# EAGLE design M105-bad (EAGLE 6.6.0)
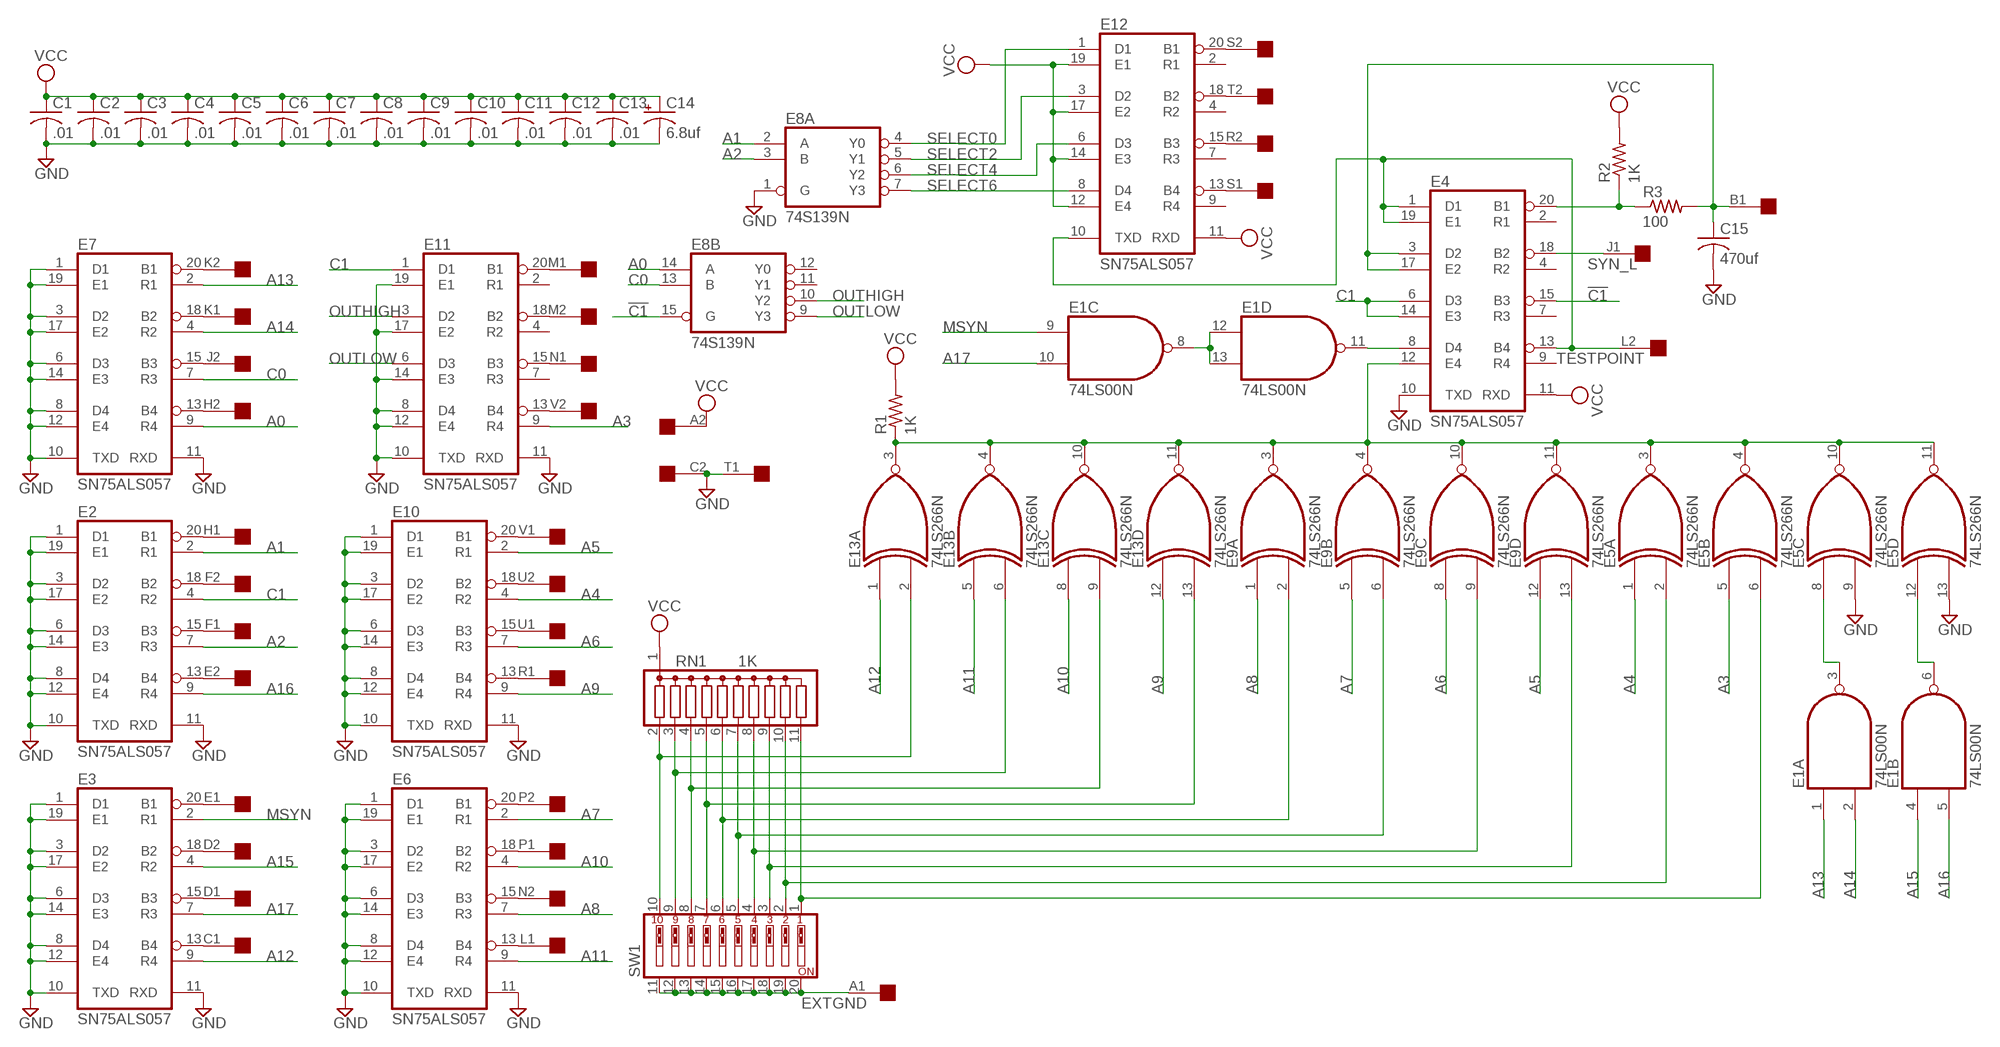
[diagram p0: schematic, sheet 1]

## Parts
C1  .01  C-US050-025X075  [C050-025X075]
C2  .01  C-US050-025X075  [C050-025X075]
C3  .01  C-US050-025X075  [C050-025X075]
C4  .01  C-US050-025X075  [C050-025X075]
C5  .01  C-US050-025X075  [C050-025X075]
C6  .01  C-US050-025X075  [C050-025X075]
C7  .01  C-US050-025X075  [C050-025X075]
C8  .01  C-US050-025X075  [C050-025X075]
C9  .01  C-US050-025X075  [C050-025X075]
C10  .01  C-US050-025X075  [C050-025X075]
C11  .01  C-US050-025X075  [C050-025X075]
C12  .01  C-US050-025X075  [C050-025X075]
C13  .01  C-US050-025X075  [C050-025X075]
C14  6.8uf  CPOL-USE15-5AXIAL  [E15-5]
C15  470uf  C-US050-025X075  [C050-025X075]
E1  74LS00N  [DIL14]
E2  SN75ALS057  [DIL20]
E3  SN75ALS057  [DIL20]
E4  SN75ALS057  [DIL20]
E5  74LS266N  [DIL14]
E6  SN75ALS057  [DIL20]
E7  SN75ALS057  [DIL20]
E8  74S139N  [DIL16]
E9  74LS266N  [DIL14]
E10  SN75ALS057  [DIL20]
E11  SN75ALS057  [DIL20]
E12  SN75ALS057  [DIL20]
E13  74LS266N  [DIL14]
R1  1K  R-US_0207/10  [0207/10]
R2  1K  R-US_0207/10  [0207/10]
R3  100  R-US_0207/10  [0207/10]
RN1  1K  G10R  [SIL11]
SW1  SW_DIP-10  [EDG-10]
U$1  SINGLE  [EDGE-CON2]

## Nets
!C1: E4.15(B3) E8.15(B:G)
A0: E7.9(R4) E8.14(B:A)
A1: E2.2(R1) E8.2(A:A)
A2: E2.7(R3) E8.3(A:B)
A3: E5.5(B:I0) E11.9(R4)
A4: E5.1(A:I0) E10.4(R2)
A5: E9.12(D:I0) E10.2(R1)
A6: E9.8(C:I0) E10.7(R3)
A7: E6.2(R1) E9.5(B:I0)
A8: E6.7(R3) E9.1(A:I0)
A9: E10.9(R4) E13.12(D:I0)
A10: E6.4(R2) E13.8(C:I0)
A11: E6.9(R4) E13.5(B:I0)
A12: E3.9(R4) E13.1(A:I0)
A13: E1.1(A:I0) E7.2(R1)
A14: E1.2(A:I1) E7.4(R2)
A15: E1.4(B:I0) E3.4(R2)
A16: E1.5(B:I1) E2.9(R4)
A17: E1.10(C:I1) E3.7(R3)
C0: E7.7(R3) E8.13(B:B)
C1: E2.4(R2) E4.6(D3) E4.14(E3) E11.1(D1)
EXTGND: SW1.11 SW1.12 SW1.13 SW1.14 SW1.15 SW1.16 SW1.17 SW1.18 SW1.19 SW1.20 U$1.A1
GND: C1.2 C2.2 C3.2 C4.2 C5.2 C6.2 C7.2 C8.2 C9.2 C10.2 C11.2 C12.2 C13.2 C14.- C15.2 E2.1(D1) E2.3(D2) E2.6(D3) E2.8(D4) E2.10(TXD) E2.11(RXD) E2.12(E4) E2.14(E3) E2.17(E2) E2.19(E1) E3.1(D1) E3.3(D2) E3.6(D3) E3.8(D4) E3.10(TXD) E3.11(RXD) E3.12(E4) E3.14(E3) E3.17(E2) E3.19(E1) E4.10(TXD) E5.9(C:I1) E5.13(D:I1) E6.1(D1) E6.3(D2) E6.6(D3) E6.8(D4) E6.10(TXD) E6.11(RXD) E6.12(E4) E6.14(E3) E6.17(E2) E6.19(E1) E7.1(D1) E7.3(D2) E7.6(D3) E7.8(D4) E7.10(TXD) E7.11(RXD) E7.12(E4) E7.14(E3) E7.17(E2) E7.19(E1) E8.1(A:G) E10.1(D1) E10.3(D2) E10.6(D3) E10.8(D4) E10.10(TXD) E10.11(RXD) E10.12(E4) E10.14(E3) E10.17(E2) E10.19(E1) E11.8(D4) E11.10(TXD) E11.11(RXD) E11.12(E4) E11.14(E3) E11.17(E2) E11.19(E1) U$1.C2 U$1.T1
MSYN: E1.9(C:I0) E3.2(R1)
N$1: E3.18(B2) U$1.D2
N$2: E3.20(B1) U$1.E1
N$3: E3.15(B3) U$1.D1
N$4: E3.13(B4) U$1.C1
N$5: E2.18(B2) U$1.F2
N$6: E2.13(B4) U$1.E2
N$7: E2.20(B1) U$1.H1
N$8: E2.15(B3) U$1.F1
N$9: E7.20(B1) U$1.K2
N$10: E7.15(B3) U$1.J2
N$11: E7.13(B4) U$1.H2
N$12: E7.18(B2) U$1.K1
N$13: E6.15(B3) U$1.N2
N$14: E6.20(B1) U$1.P2
N$15: E6.13(B4) U$1.L1
N$16: E6.18(B2) U$1.P1
N$17: E10.18(B2) U$1.U2
N$18: E11.13(B4) U$1.V2
N$19: E10.13(B4) U$1.R1
N$20: E10.15(B3) U$1.U1
N$21: E10.20(B1) U$1.V1
N$22: E4.20(B1) R2.1 R3.1
N$23: E12.20(B1) U$1.S2
N$24: E12.18(B2) U$1.T2
N$25: E12.13(B4) U$1.S1
N$26: E12.15(B3) U$1.R2
N$27: E11.18(B2) U$1.M2
N$28: E11.15(B3) U$1.N1
N$29: E1.3(A:O) E5.8(C:I0)
N$30: E1.6(B:O) E5.12(D:I0)
N$31: E1.8(C:O) E1.12(D:I0) E1.13(D:I1)
N$32: E1.11(D:O) E4.8(D4)
N$33: E5.6(B:I1) RN1.11 SW1.1
N$34: E5.2(A:I1) RN1.10 SW1.2
N$35: E9.13(D:I1) RN1.9 SW1.3
N$36: E9.9(C:I1) RN1.8 SW1.4
N$37: E9.6(B:I1) RN1.7 SW1.5
N$38: E9.2(A:I1) RN1.6 SW1.6
N$39: E13.13(D:I1) RN1.5 SW1.7
N$40: E13.9(C:I1) RN1.4 SW1.8
N$41: E13.6(B:I1) RN1.3 SW1.9
N$42: E13.2(A:I1) RN1.2 SW1.10
N$43: E4.12(E4) E5.3(A:O) E5.4(B:O) E5.10(C:O) E5.11(D:O) E9.3(A:O) E9.4(B:O) E9.10(C:O) E9.11(D:O) E13.3(A:O) E13.4(B:O) E13.10(C:O) E13.11(D:O) R1.1
N$44: C15.1 E4.3(D2) E4.17(E2) R3.2 U$1.B1
N$45: E11.20(B1) U$1.M1
OUTHIGH: E8.10(B:Y2) E11.3(D2)
OUTLOW: E8.9(B:Y3) E11.6(D3)
SELECT0: E8.4(A:Y0) E12.1(D1)
SELECT2: E8.5(A:Y1) E12.3(D2)
SELECT4: E8.6(A:Y2) E12.6(D3)
SELECT6: E8.7(A:Y3) E12.8(D4)
SYN_L: E4.18(B2) U$1.J1
TESTPOINT: E4.1(D1) E4.13(B4) E4.19(E1) E12.10(TXD) U$1.L2
VCC: C1.1 C2.1 C3.1 C4.1 C5.1 C6.1 C7.1 C8.1 C9.1 C10.1 C11.1 C12.1 C13.1 C14.+ E4.11(RXD) E12.11(RXD) E12.12(E4) E12.14(E3) E12.17(E2) E12.19(E1) R1.2 R2.2 RN1.1 U$1.A2
Unconnected: E4.2(R1) E4.4(R2) E4.7(R3) E4.9(R4) E8.11(B:Y1) E8.12(B:Y0) E11.2(R1) E11.4(R2) E11.7(R3) E12.2(R1) E12.4(R2) E12.7(R3) E12.9(R4) U$1.B2

## Power pins joined to a net without a drawn wire
GND: E1.7(P:GND) E2.16(GND) E3.16(GND) E4.16(GND) E5.7(P:GND) E6.16(GND) E7.16(GND) E8.8(P:GND) E9.7(P:GND) E10.16(GND) E11.16(GND) E12.16(GND) E13.7(P:GND)
VCC: E1.14(P:VCC) E2.5(VCC) E3.5(VCC) E4.5(VCC) E5.14(P:VCC) E6.5(VCC) E7.5(VCC) E8.16(P:VCC) E9.14(P:VCC) E10.5(VCC) E11.5(VCC) E12.5(VCC) E13.14(P:VCC)

## Library data of the parts
C1-C13 C15 = rcl:C-US: CAPACITOR, American symbol
C14 = rcl:CPOL-US: POLARIZED CAPACITOR, American symbol
E1 = 74xx-us:74*00: Quad 2-input NAND gate
E2-E4 E6 E7 E10-E12 = dec-con:SN75ALS057: Qbus-likeTransceiver
E5 E9 E13 = 74xx-us:74*266: Quadruple EXCLUSIVE-NOR (XNOR), open-collector
E8 = 74xx-us:74*139: Dual 2-line to 4-line DECODER/DEMULTIPLEXER
R1-R3 = rcl:R-US_: RESISTOR, American symbol
RN1 = resistor-sil:G10R: SIL RESISTOR; OC_FARNELL: unknown; OC_NEWARK: unknown
SW1 = special:SW_DIP-10: DIP SWITCH
U$1 = dec-con:SINGLE: Single-Height DEC board

## Board
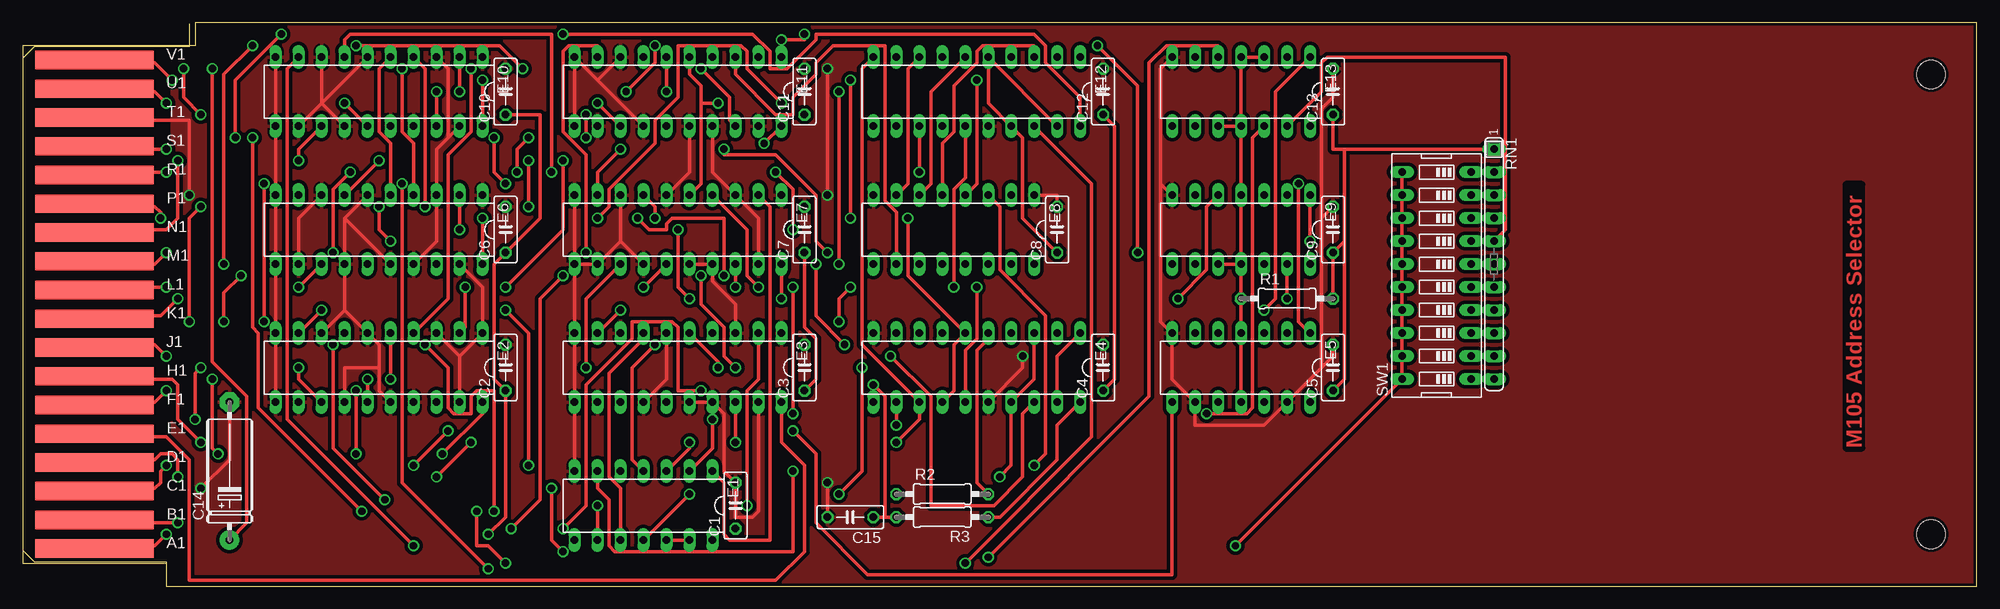
[diagram p1: board, top side]
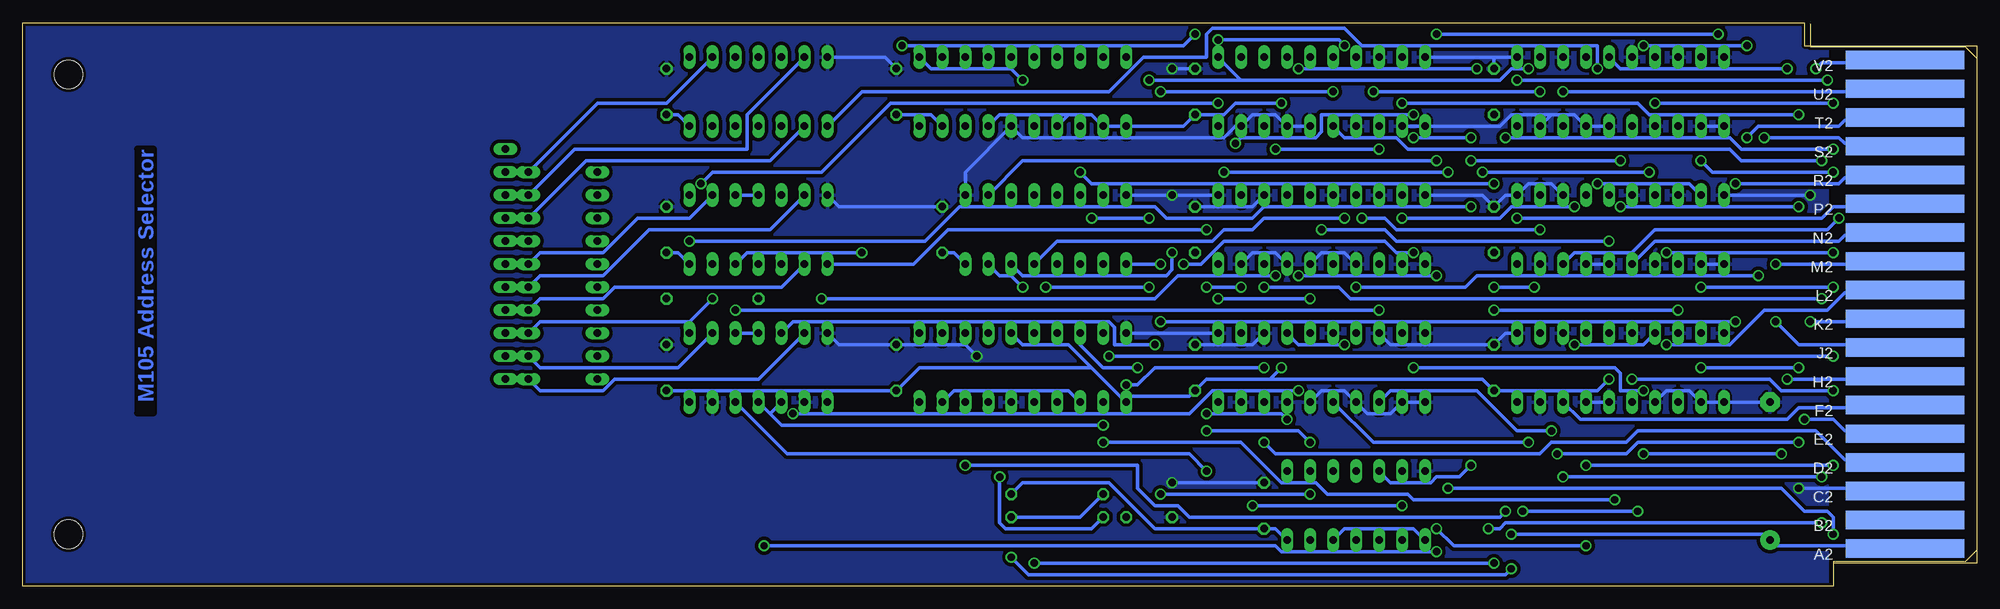
[diagram p2: board, bottom side, seen from below]

Size 215.9 x 62.23 mm. Coordinates in mm from the lower left corner, seen from the top.
Outline: 19.05,62.23 19.05,59.69 0,59.69 0,2.54 15.88,2.54 15.88,0 215.9,0 215.9,62.23 19.05,62.23
Copper layers (1+16): Top 0.035mm / dielectric 1.5mm / Bottom 0.035mm
Design rules "16mils": minimum track width 16mil, minimum drill 32mil, track to track 15mil, track to pad 10mil, pad to pad 10mil, via to via 10mil, smd to smd 10mil, copper to edge 13mil, drill to drill 10mil, minimum pad ring 10mil, minimum via ring 8mil, stop-mask expansion 0mil, vias tented up to drill 0mil, thermal gap 10mil
Holes 3.17 mm at 210.82,56.52 210.82,5.71

### Footprints (pad centres in the part's own frame; a part is rotated, then mirrored left to right if it is on the bottom)
C050-025X075 = drill 0.813 octagon: 1 -2.54,0; 2 2.54,0
E15-5 = drill 0.813 pad 2.159: + -7.62,0 | drill 0.813 pad 2.159 octagon: - 7.62,0
DIL14 = drill 0.813 long: 1 -7.62,-3.81; 2 -5.08,-3.81; 3 -2.54,-3.81; 4 0,-3.81; 5 2.54,-3.81; 6 5.08,-3.81; 7 7.62,-3.81; 8 7.62,3.81; 9 5.08,3.81; 10 2.54,3.81; 11 0,3.81; 12 -2.54,3.81; 13 -5.08,3.81; 14 -7.62,3.81
DIL20 = drill 0.813 long: 1 -8.89,-3.81; 2 -6.35,-3.81; 3 -3.81,-3.81; 4 -1.27,-3.81; 5 1.27,-3.81; 6 3.81,-3.81; 7 6.35,-3.81; 8 8.89,-3.81; 9 11.43,-3.81; 10 13.97,-3.81; 11 13.97,3.81; 12 11.43,3.81; 13 8.89,3.81; 14 6.35,3.81; 15 3.81,3.81; 16 1.27,3.81; 17 -1.27,3.81; 18 -3.81,3.81; 19 -6.35,3.81; 20 -8.89,3.81
DIL16 = drill 0.813 long: 1 -8.89,-3.81; 2 -6.35,-3.81; 3 -3.81,-3.81; 4 -1.27,-3.81; 5 1.27,-3.81; 6 3.81,-3.81; 7 6.35,-3.81; 8 8.89,-3.81; 9 8.89,3.81; 10 6.35,3.81; 11 3.81,3.81; 12 1.27,3.81; 13 -1.27,3.81; 14 -3.81,3.81; 15 -6.35,3.81; 16 -8.89,3.81
0207/10 = drill 0.813 octagon: 1 -5.08,0; 2 5.08,0
SIL11 = drill 0.813 long: 1 -12.7,0; 2 -10.16,0; 3 -7.62,0; 4 -5.08,0; 5 -2.54,0; 6 0,0; 7 2.54,0; 8 5.08,0; 9 7.62,0; 10 10.16,0; 11 12.7,0
EDG-10 = drill 0.813 long: 1 -11.43,-3.81; 2 -8.89,-3.81; 3 -6.35,-3.81; 4 -3.81,-3.81; 5 -1.27,-3.81; 6 1.27,-3.81; 7 3.81,-3.81; 8 6.35,-3.81; 9 8.89,-3.81; 10 11.43,-3.81; 11 11.43,3.81; 12 8.89,3.81; 13 6.35,3.81; 14 3.81,3.81; 15 1.27,3.81; 16 -1.27,3.81; 17 -3.81,3.81; 18 -6.35,3.81; 19 -8.89,3.81; 20 -11.43,3.81
EDGE-CON2 = smd 13.106 x 2.032: A1 7.938,4.128; B1 7.938,7.303; C1 7.938,10.477; D1 7.938,13.652; E1 7.938,16.828; F1 7.938,20.003; H1 7.938,23.177; J1 7.938,26.352; K1 7.938,29.527; L1 7.938,32.703; M1 7.938,35.877; N1 7.938,39.053; P1 7.938,42.227; R1 7.938,45.403; S1 7.938,48.578; T1 7.938,51.752; U1 7.938,54.928; V1 7.938,58.102 | smd 13.106 x 2.032 bottom: A2 7.938,4.128; B2 7.938,7.303; C2 7.938,10.477; D2 7.938,13.652; E2 7.938,16.828; F2 7.938,20.003; H2 7.938,23.177; J2 7.938,26.352; K2 7.938,29.527; L2 7.938,32.703; M2 7.938,35.877; N2 7.938,39.053; P2 7.938,42.227; R2 7.938,45.403; S2 7.938,48.578; T2 7.938,51.752; U2 7.938,54.928; V2 7.938,58.102

### Placement (x,y rotation side)
C1  78.74,8.89 90 top
C2  53.34,24.13 90 top
C3  86.36,24.13 90 top
C4  119.38,24.13 90 top
C5  144.78,24.13 90 top
C6  53.34,39.37 90 top
C7  86.36,39.37 90 top
C8  114.3,39.37 90 top
C9  144.78,39.37 90 top
C10  53.34,54.61 90 top
C11  86.36,54.61 90 top
C12  119.38,54.61 90 top
C13  144.78,54.61 90 top
C14  22.86,12.7 90 top
C15  91.44,7.62 180 top
E1  68.58,8.89 180 top
E2  41.91,24.13 180 top
E3  74.93,24.13 180 top
E4  107.95,24.13 180 top
E5  134.62,24.13 180 top
E6  41.91,39.37 180 top
E7  74.93,39.37 180 top
E8  102.87,39.37 180 top
E9  134.62,39.37 180 top
E10  41.91,54.61 180 top
E11  74.93,54.61 180 top
E12  107.95,54.61 180 top
E13  134.62,54.61 180 top
R1  139.7,31.75 0 top
R2  101.6,10.16 0 top
R3  101.6,7.62 180 top
RN1  162.56,35.56 270 top
SW1  156.21,34.29 90 top
U$1  0,0 0 top

### Tracks (layer width: path | path; a pad name or v marks a point on that pad's centre or on a via)
!C1  (via drill 0.81)
  Top 0.406: E4.15 104.14,26.04 105.41,27.3 v105.41,33.02
  Bottom 0.406: v105.41,33.02 106.68,34.29 107.95,34.29 E8.15
A0  (via drill 0.81)
  Top 0.406: v88.9,36.83 87.63,38.1 87.63,43.18 83.19,47.62 77.47,47.62 v77.47,48.26 | v66.04,48.26 63.5,45.72 E7.9
  Bottom 0.406: E8.14 105.41,34.29 89.54,34.29 88.9,34.92 v88.9,36.83 | v66.04,48.26 v77.47,48.26
A1  (via drill 0.81)
  Top 0.406: E2.2 48.9,28.57 v48.9,33.02 | v53.34,33.02 59.69,39.37 v59.69,46.99
  Bottom 0.406: v53.34,33.02 v48.9,33.02 | v59.69,46.99 105.41,46.99 E8.2
A2  (via drill 0.81)
  Top 0.406: v44.45,26.67 46.99,24.13 46.99,19.68 47.63,19.05 49.53,19.05 49.53,20.95 50.17,21.59 52.07,21.59 v52.07,8.26 | v111.76,13.34 113.03,14.61 113.03,29.84 107.95,34.92 107.95,41.91 E8.3
  Bottom 0.406: E2.7 36.83,26.67 v44.45,26.67 | v52.07,8.26 52.71,7.62 87,7.62 88.27,8.89 90.81,8.89 92.71,10.79 92.71,13.34 v111.76,13.34
A3  (via drill 0.81)
  Top 0.406: v90.81,26.67 87.63,29.84 v87.63,35.56 | v62.23,36.83 62.23,47.62 59.69,50.16 59.69,59.05 60.33,59.69 63.5,59.69 E11.9
  Bottom 0.406: E5.5 130.81,29.21 95.89,29.21 95.25,28.57 95.25,26.67 v90.81,26.67 | v87.63,35.56 85.73,35.56 83.19,38.1 65.41,38.1 64.14,36.83 v62.23,36.83
A4  (via drill 0.81)
  Top 0.406: E5.1 140.97,29.21 v140.97,44.45 | v83.82,53.34 80.01,57.15 80.01,59.05 79.38,59.69 72.39,59.69 72.39,53.98 69.85,51.44 69.85,48.9 64.77,43.81 64.77,41.91 v63.5,40.64 | v44.45,41.91 44.45,57.15 E10.4
  Bottom 0.406: v140.97,44.45 139.7,45.72 127.64,45.72 120.02,53.34 v83.82,53.34 | v63.5,40.64 52.71,40.64 51.44,41.91 v44.45,41.91
A5  (via drill 0.81)
  Top 0.406: v48.26,54.61 E10.2 | v66.68,54.61 69.85,57.78 v69.85,59.69 | v83.82,60.33 86.36,60.33 v86.36,60.96 | v118.75,59.69 123.19,55.24 v123.19,36.83
  Bottom 0.406: v66.68,54.61 v48.26,54.61 | v69.85,59.69 70.49,60.33 v83.82,60.33 | v86.36,60.96 87.63,59.69 v118.75,59.69 | v123.19,36.83 135.89,36.83 E9.12
A6  (via drill 0.81)
  Top 0.406: E10.7 35.56,60.33 36.2,60.96 58.42,60.96 v58.42,45.72 | v83.19,45.72 85.09,43.81 v85.09,39.37
  Bottom 0.406: v83.19,45.72 v58.42,45.72 | v85.09,39.37 113.67,39.37 117.48,35.56 E9.8
A7  (via drill 0.81)
  Top 0.406: v48.26,39.37 E6.2 | v67.95,40.64 69.22,39.37 71.12,39.37 71.12,40.01 71.76,40.64 77.47,40.64 v77.47,34.29 | v127.64,31.75 130.81,34.92 130.81,41.91 E9.5
  Bottom 0.406: v48.26,39.37 64.14,39.37 65.41,40.64 v67.95,40.64 | v77.47,34.29 88.27,34.29 90.81,31.75 v127.64,31.75
A8  (via drill 0.81)
  Top 0.406: v39.37,46.99 E6.7 | v55.88,41.91 v55.88,46.99 | E9.1 v142.24,38.1
  Bottom 0.406: v55.88,46.99 v39.37,46.99 | v55.88,41.91 78.74,41.91 80.01,40.64 89.54,40.64 90.81,41.91 112.4,41.91 116.21,38.1 v142.24,38.1
A9  (via drill 0.81)
  Top 0.406: E13.12 135.89,49.53 135.89,19.68 135.26,19.05 v130.81,19.05 | v74.93,21.59 72.39,21.59 72.39,28.57 71.76,29.21 67.31,29.21 67.31,27.3 62.23,22.23 62.23,8.89 v59.69,6.35 | v43.18,4.45 29.21,18.41 29.21,57.15 E10.9
  Bottom 0.406: v130.81,19.05 87,19.05 84.46,21.59 v74.93,21.59 | v59.69,6.35 57.79,4.45 v43.18,4.45
A10  (via drill 0.81)
  Top 0.406: E6.4 43.18,48.9 41.91,50.16 v41.91,57.15
  Bottom 0.406: v41.91,57.15 41.91,59.69 67.95,59.69 69.85,61.59 84.46,61.59 85.09,60.96 85.09,58.42 92.08,58.42 95.89,54.61 123.19,54.61 E13.8
A11  (via drill 0.81)
  Top 0.406: v41.91,44.45 41.91,11.43 v51.44,1.91 | v106.68,3.17 124.46,20.95 124.46,57.78 126.37,59.69 132.08,59.69 E13.5
  Bottom 0.406: E6.9 31.75,44.45 v41.91,44.45 | v51.44,1.91 52.07,1.27 104.78,1.27 v106.68,3.17
A12  (via drill 0.81)
  Top 0.406: v66.04,30.48 E3.9 | v137.16,30.48 138.43,31.75 138.43,54.61 E13.1
  Bottom 0.406: v137.16,30.48 v66.04,30.48
A13
  Top 0.406: E1.1 77.47,11.43 77.47,5.71 78.11,5.08 82.55,5.08 82.55,41.91 E7.2
A14  (via drill 0.81)
  Top 0.406: E1.2 76.2,15.24 v76.2,18.41 | v85.09,33.02 v85.09,19.05 | v81.28,33.02 80.01,34.29 80.01,39.37 E7.4
  Bottom 0.406: v76.2,18.41 76.84,19.05 v85.09,19.05 | v81.28,33.02 v85.09,33.02
A15  (via drill 0.81)
  Top 0.406: E1.4 67.31,13.97 67.31,24.13 v69.85,26.67
  Bottom 0.406: v69.85,26.67 74.93,26.67 E3.4
A16  (via drill 0.81)
  Top 0.406: v33.02,30.48 E2.9 | v53.34,30.48 55.88,27.94 v55.88,13.34
  Bottom 0.406: v53.34,30.48 v33.02,30.48 | v55.88,13.34 57.15,12.06 59.69,12.06 60.33,11.43 64.77,11.43 E1.5
A17
  Top 0.406: E1.10 66.04,10.79 64.77,12.06 64.77,23.5 68.58,27.3 E3.7
C0  (via drill 0.81)
  Top 0.406: E7.7 69.85,41.91 v69.85,40.64
  Bottom 0.406: v69.85,40.64 78.74,40.64 80.01,39.37 83.19,39.37 84.46,38.1 101.6,38.1 E8.13
C1  (via drill 0.81)
  Top 0.406: E4.14 102.87,21.59 102.87,26.67 E4.6 97.79,34.29 v97.79,40.64 | E2.4 46.99,31.75 46.99,47.62 49.53,50.16 v49.53,57.15 | v91.44,55.88 v91.44,40.64
  Bottom 0.406: v49.53,57.15 51.44,57.15 52.71,55.88 81.28,55.88 | E11.1 81.28,55.88 | v91.44,40.64 v97.79,40.64 | 81.28,55.88 v91.44,55.88
EXTGND  (via drill 0.81)
  Top 0.406: SW1.11 SW1.12 SW1.13 SW1.14 SW1.15 SW1.16 SW1.17 SW1.18 SW1.19 SW1.20 v133.99,4.45 | v59.69,3.81 58.42,5.08 v58.42,10.79 | v15.88,5.71 14.61,4.45 8.26,4.45 U$1.A1
  Bottom 0.406: v133.99,4.45 77.47,4.45 76.84,3.81 v59.69,3.81 | v58.42,10.79 21.59,10.79 19.05,8.26 16.51,8.26 15.88,7.62 v15.88,5.71
GND  (via drill 0.81)
  Top 0.406: 35.56,30.48 E2.8 | 35.56,30.48 E6.14 35.56,40.64 | 35.56,30.48 E2.6 39.37,26.67 39.37,24.13 | 35.56,40.64 E6.6 | E2.16 39.37,21.59 39.37,24.13 | 35.56,40.64 E6.16 | 33.02,53.34 E10.14 | E10.8 33.02,53.34 | 33.02,53.34 E10.6 | E10.10 E10.11 E6.10 E6.11 E2.10 E2.11 | E10.12 33.02,53.34 | E6.8 30.48,40.64 E6.12 | v19.69,10.79 22.86,13.97 C14.- | v18.42,43.18 18.42,51.44 8.26,51.44 U$1.T1 | 39.37,24.13 35.56,24.13 E2.14 | 143.51,24.13 144.78,25.4 C5.2 | 143.51,24.13 E5.13 137.16,17.78 129.54,17.78 E5.9 127,22.86 E5.7 125.73,29.21 125.73,44.45 | 143.51,40.64 C9.2 | 143.51,24.13 143.51,40.64 | C13.2 144.78,53.98 143.51,52.7 143.51,40.64 | E4.16 110.49,24.13 v110.49,25.4 | E8.1 114.3,43.18 C8.2 | E13.7 125.73,57.15 125.73,44.45 | E9.7 125.73,44.45 | E7.6 73.66,45.72 E11.16 | v88.9,43.18 v88.9,57.15 | E11.17 76.2,45.72 E7.3 81.28,40.64 E7.19 | E7.16 E7.17 76.2,33.66 78.74,31.11 E3.3 | 66.04,38.1 E7.14 | E7.8 66.04,38.1 | 63.5,55.88 E11.10 E11.11 | 63.5,55.88 E11.14 | 63.5,55.88 E11.8 | 46.99,49.53 45.72,48.26 E6.3 45.72,38.1 E6.17 | 46.99,49.53 E10.19 | E10.3 46.99,57.15 46.99,49.53 | 48.26,25.4 E2.19 | E2.3 48.26,25.4 | E6.19 50.8,33.02 E2.1 48.26,25.4 | E3.16 E3.17 77.47,19.05 77.47,12.7 C1.2 78.74,7.62 80.65,7.62 81.28,8.26 E3.19 | v88.9,11.43 C15.2 | E3.14 71.12,22.86 E3.6 | E1.7 E3.11 E3.10 E7.11 | E7.11 E7.10 | E7.11 E7.12 66.04,38.1
  Bottom 0.406: E6.17 E6.16 | E2.17 E2.16 | E10.11 E10.12 | E2.14 34.29,21.59 31.75,21.59 E2.12 E2.11 C14.- | E6.11 E6.12 | v19.69,10.79 8.26,10.79 U$1.C2 | E6.10 v18.42,43.18 | v110.49,25.4 111.76,26.67 C4.2 125.73,26.67 E5.7 | C12.2 120.65,58.42 E13.7 | E8.1 111.76,45.72 E12.16 105.41,49.53 83.19,49.53 81.92,50.8 E11.19 80.01,52.07 77.47,52.07 E11.17 E11.16 | E9.7 125.73,41.91 C8.2 | E7.3 80.01,41.91 83.82,41.91 | C7.2 83.82,41.91 | 83.82,41.91 E7.1 v88.9,43.18 E8.8 | v88.9,57.15 C11.2 | E3.3 80.01,26.67 83.82,26.67 | C3.2 83.82,26.67 | 83.82,26.67 E3.1 E4.10 | E7.19 80.01,36.83 77.47,36.83 E7.17 | E7.16 72.39,36.83 69.85,36.83 E7.14 | E11.12 E11.11 52.71,50.8 51.44,52.07 46.99,52.07 | E11.10 53.34,58.42 | 53.34,58.42 E10.1 | 53.34,58.42 C10.2 | E10.16 E10.17 44.45,52.07 46.99,52.07 | E6.3 46.99,44.45 49.53,44.45 E6.1 52.07,43.18 C6.2 54.61,43.18 E7.10 | E10.19 46.99,52.07 | E2.1 52.07,27.94 C2.2 60.96,26.67 | E3.8 64.77,26.67 60.96,26.67 | C1.2 v88.9,11.43 | E3.11 E3.12 64.77,19.05 67.31,19.05 E3.14 69.85,21.59 72.39,21.59 E3.16 | E3.10 60.96,26.67
  pour Top (isolate 0.305): 16.51,62.23 215.9,62.23 215.9,0 16.51,0
  pour Bottom (isolate 0.305): 16.51,62.23 215.9,62.23 215.9,0 16.51,0
MSYN  (via drill 0.81)
  Top 0.406: v63.5,8.89 E1.9 | v80.01,8.89 80.01,21.59 81.28,22.86 E3.2
  Bottom 0.406: v80.01,8.89 v63.5,8.89
N$1  (via drill 0.81)
  Top 0.406: v78.74,15.88 E3.18
  Bottom 0.406: v78.74,15.88 77.47,14.61 48.26,14.61 46.99,15.88 38.74,15.88 37.47,17.14 17.78,17.14 14.61,13.97 8.26,13.97 U$1.D2
N$2
  Top 0.406: E3.20 83.82,15.88 86.36,13.34 86.36,3.81 83.19,0.64 18.42,0.64 18.42,13.97 15.88,16.51 8.26,16.51 U$1.E1
N$3  (via drill 0.81)
  Top 0.406: v45.72,12.06 v49.53,15.88 | v17.15,12.06 17.15,13.97 16.51,14.61 15.24,14.61 14.61,13.97 8.26,13.97 U$1.D1
  Bottom 0.406: E3.15 66.68,15.88 v49.53,15.88 | v17.15,12.06 v45.72,12.06
N$4  (via drill 0.81)
  Top 0.406: v43.18,13.34 v46.99,17.14 | v15.88,13.34 15.24,12.7 15.24,11.43 14.61,10.79 8.26,10.79 U$1.C1
  Bottom 0.406: E3.13 64.77,21.59 55.25,21.59 50.8,17.14 v46.99,17.14 | v15.88,13.34 v43.18,13.34
N$5
  Bottom 0.406: E2.18 43.82,18.41 20.96,18.41 19.69,19.68 8.26,19.68 U$1.F2
N$6  (via drill 0.81)
  Top 0.406: E2.13 30.48,22.86 v30.48,24.13 | v19.69,24.13 19.05,23.5 v19.05,18.41
  Bottom 0.406: v19.69,24.13 v30.48,24.13 | v19.05,18.41 15.88,18.41 14.61,17.14 8.26,17.14 U$1.E2
N$7  (via drill 0.81)
  Top 0.406: E2.20 50.8,19.05 v46.36,14.61 | v19.69,15.88 17.15,18.41 17.15,22.23 16.51,22.86 8.26,22.86 U$1.H1
  Bottom 0.406: v46.36,14.61 38.74,14.61 37.47,15.88 v19.69,15.88
N$8  (via drill 0.81)
  Top 0.406: v38.1,22.86 E2.15 | v15.88,21.59 14.61,20.32 8.26,20.32 U$1.F1
  Bottom 0.406: v38.1,22.86 22.86,22.86 21.59,21.59 v15.88,21.59
N$9  (via drill 0.81)
  Top 0.406: v83.82,31.75 E7.20 | v73.66,31.75 72.39,33.02 v72.39,39.37 | v40.64,38.1 39.37,39.37 v39.37,41.91 | v19.69,41.91 18.42,40.64 v18.42,29.21
  Bottom 0.406: v73.66,31.75 v83.82,31.75 | v72.39,39.37 65.41,39.37 64.14,38.1 v40.64,38.1 | v19.69,41.91 v39.37,41.91 | v18.42,29.21 8.26,29.21 U$1.K2
N$10  (via drill 0.81)
  Top 0.406: v68.58,33.02 E7.15 | v24.13,34.29 22.23,32.38 v22.23,29.21
  Bottom 0.406: v68.58,33.02 56.52,33.02 55.25,34.29 v24.13,34.29 | v22.23,29.21 19.69,26.67 8.26,26.67 U$1.J2
N$11  (via drill 0.81)
  Top 0.406: E7.13 62.23,31.75 v62.23,24.13 | v36.83,14.61 v36.83,21.59 | v21.59,14.61 20.96,15.24 v20.96,22.86
  Bottom 0.406: v62.23,24.13 40.01,24.13 39.37,23.5 39.37,21.59 v36.83,21.59 | v21.59,14.61 v36.83,14.61 | v20.96,22.86 8.26,22.86 U$1.H2
N$12  (via drill 0.81)
  Top 0.406: v78.74,33.02 E7.18 | v17.15,31.75 15.24,29.84 8.26,29.84 U$1.K1
  Bottom 0.406: v78.74,33.02 70.49,33.02 69.22,31.75 v17.15,31.75
N$13
  Bottom 0.406: E6.15 35.56,38.1 15.24,38.1 14.61,38.73 8.26,38.73 U$1.N2
N$14  (via drill 0.81)
  Top 0.406: v50.8,40.64 E6.20
  Bottom 0.406: v50.8,40.64 17.15,40.64 15.88,41.91 8.26,41.91 U$1.P2
N$15  (via drill 0.81)
  Top 0.406: v30.48,33.02 E6.13 | v15.88,33.02 8.26,33.02 U$1.L1
  Bottom 0.406: v15.88,33.02 v30.48,33.02
N$16  (via drill 0.81)
  Top 0.406: v15.24,40.64 15.24,41.27 14.61,41.91 8.26,41.91 U$1.P1
  Bottom 0.406: E6.18 44.45,36.83 38.1,36.83 35.56,39.37 16.51,39.37 v15.24,40.64
N$17  (via drill 0.81)
  Top 0.406: v45.72,54.61 E10.18
  Bottom 0.406: v45.72,54.61 8.26,54.61 U$1.U2
N$18  (via drill 0.81)
  Top 0.406: v63.5,53.34 E11.13 | v19.69,52.07 17.78,53.98 v17.78,57.15
  Bottom 0.406: v63.5,53.34 37.47,53.34 36.2,52.07 v19.69,52.07 | v17.78,57.15 17.15,57.78 8.26,57.78 U$1.V2
N$19  (via drill 0.81)
  Top 0.406: E10.13 30.48,48.26 v30.48,46.99 | v15.88,45.72 8.26,45.72 U$1.R1
  Bottom 0.406: v30.48,46.99 29.21,45.72 v15.88,45.72
N$20  (via drill 0.81)
  Top 0.406: v35.56,53.34 E10.15 | v15.88,53.34 14.61,54.61 8.26,54.61 U$1.U1
  Bottom 0.406: v15.88,53.34 v35.56,53.34
N$21  (via drill 0.81)
  Top 0.406: v50.8,55.88 E10.20 | v16.51,55.88 14.61,57.78 8.26,57.78 U$1.V1
  Bottom 0.406: v16.51,55.88 v50.8,55.88
N$22
  Top 0.406: E4.20 114.3,17.78 114.3,13.97 107.95,7.62 R3.1
  Bottom 0.406: R2.1 99.06,7.62 R3.1
N$23  (via drill 0.81)
  Top 0.406: E12.20 116.84,53.98 113.03,57.78 113.03,59.69 111.76,60.96 87.63,60.96 87.63,60.33 84.46,57.15 82.55,57.15 82.55,59.05 80.65,60.96 v59.69,60.96 | v28.58,60.96 23.5,55.88 v23.5,49.53
  Bottom 0.406: v28.58,60.96 v59.69,60.96 | v23.5,49.53 15.24,49.53 14.61,48.9 8.26,48.9 U$1.S2
N$24  (via drill 0.81)
  Top 0.406: E12.18 118.11,44.45 118.11,16.51 v104.14,2.54 | v53.34,2.54 51.44,4.45 50.17,4.45 v50.17,8.26 | v37.47,8.26 26.04,19.68 26.04,27.94 25.4,28.57 v25.4,49.53
  Bottom 0.406: v53.34,2.54 v104.14,2.54 | v37.47,8.26 v50.17,8.26 | v25.4,49.53 24.13,50.8 15.24,50.8 14.61,51.44 8.26,51.44 U$1.T2
N$25  (via drill 0.81)
  Top 0.406: v99.06,45.72 E12.13 | v53.34,44.45 52.07,45.72 v52.07,49.53 | v15.88,48.26 8.26,48.26 U$1.S1
  Bottom 0.406: v99.06,45.72 97.79,44.45 v53.34,44.45 | v52.07,49.53 27.31,49.53 26.04,48.26 v15.88,48.26
N$26  (via drill 0.81)
  Top 0.406: E12.15 104.14,45.09 102.87,43.81 v102.87,33.02 | v91.44,33.02 90.17,31.75 v90.17,29.21 | v26.67,44.45 v26.67,29.21
  Bottom 0.406: v91.44,33.02 v102.87,33.02 | v26.67,29.21 v90.17,29.21 | v26.67,44.45 15.24,44.45 14.61,45.09 8.26,45.09 U$1.R2
N$27  (via drill 0.81)
  Top 0.406: E11.18 78.11,51.44 78.11,53.98 v74.93,57.15 | v55.25,57.15 52.71,59.69 v36.83,59.69 | v25.4,59.69 22.23,56.52 v22.23,35.56
  Bottom 0.406: v55.25,57.15 v74.93,57.15 | v25.4,59.69 v36.83,59.69 | v22.23,35.56 8.26,35.56 U$1.M2
N$28  (via drill 0.81)
  Top 0.406: v17.15,46.99 17.15,40.64 15.88,39.37 8.26,39.37 U$1.N1
  Bottom 0.406: E11.15 69.85,49.53 64.14,49.53 62.87,48.26 27.31,48.26 26.04,46.99 v17.15,46.99
N$29  (via drill 0.81)
  Top 0.406: E1.3 73.66,15.24 v73.66,15.88 | v85.09,17.14 87.63,14.61 87.63,6.99 93.35,1.27 127,1.27 E5.8
  Bottom 0.406: v73.66,15.88 74.93,17.14 v85.09,17.14
N$30  (via drill 0.81)
  Top 0.406: E1.6 63.5,10.79 64.77,9.53 64.77,4.45 65.41,3.81 85.09,3.81 v85.09,12.7
  Bottom 0.406: v85.09,12.7 87,14.61 131.45,14.61 E5.12
N$31
  Top 0.406: E1.12 E1.13
  Bottom 0.406: E1.8 62.23,6.35 69.85,6.35 E1.12
N$32  (via drill 0.81)
  Top 0.406: v73.66,10.16 E1.11 | v90.17,10.16 92.71,12.7 v92.71,24.13
  Bottom 0.406: v90.17,10.16 v73.66,10.16 | v92.71,24.13 96.52,24.13 99.06,26.67 E4.8
N$33
  Top 0.406: RN1.11 SW1.1
  Bottom 0.406: E5.6 134.62,22.86 150.5,22.86 151.77,21.59 158.75,21.59 SW1.1
N$34
  Top 0.406: RN1.10 SW1.2
  Bottom 0.406: E5.2 143.51,24.13 158.75,24.13 SW1.2
N$35  (via drill 0.81)
  Top 0.406: RN1.9 SW1.3 | v139.7,31.75 E9.13
  Bottom 0.406: v139.7,31.75 142.24,29.21 158.75,29.21 SW1.3
N$36
  Top 0.406: RN1.8 SW1.4
  Bottom 0.406: E9.9 132.08,33.02 150.5,33.02 151.77,31.75 158.75,31.75 SW1.4
N$37
  Top 0.406: RN1.7 SW1.5
  Bottom 0.406: E9.6 133.35,39.37 146.69,39.37 151.77,34.29 158.75,34.29 SW1.5
N$38
  Top 0.406: RN1.6 SW1.6
  Bottom 0.406: E9.2 142.24,40.64 147.96,40.64 151.77,36.83 158.75,36.83 SW1.6
N$39
  Top 0.406: SW1.7 RN1.5 163.83,39.37 163.83,58.42 144.15,58.42 143.51,57.78 143.51,54.61 E13.13
N$40
  Top 0.406: RN1.4 SW1.8
  Bottom 0.406: E13.9 133.35,46.99 153.67,46.99 SW1.8
N$41
  Top 0.406: RN1.3 SW1.9
  Bottom 0.406: E13.6 135.89,52.07 135.89,48.26 154.94,48.26 SW1.9
N$42
  Top 0.406: RN1.2 SW1.10
  Bottom 0.406: E13.2 144.78,53.34 152.4,53.34 SW1.10
N$43  (via drill 0.81)
  Top 0.406: E13.11 E13.10 | E13.3 E13.4 E13.11 | E13.11 E9.4 E9.11 | E9.11 R1.1 E5.4 E5.11 | E9.11 E9.10 | v96.52,17.78 E4.12
  Bottom 0.406: E9.3 E9.4 | E5.3 E5.4 | v96.52,17.78 132.08,17.78 133.35,19.05 | E5.11 133.35,19.05 | 133.35,19.05 E5.10
N$44  (via drill 0.81)
  Top 0.406: R3.2 95.25,7.62 | 95.25,7.62 C15.1 | E4.3 111.76,22.86 E4.17 109.22,13.34 v107.95,12.06 | v17.15,6.99 8.26,6.99 U$1.B1 | v53.98,6.35 57.15,9.53 57.15,31.75 v59.69,34.29 | v74.93,34.29 74.93,31.11 77.47,28.57 77.47,25.4 v78.74,24.13 | v93.98,22.23 95.25,20.95 95.25,7.62
  Bottom 0.406: R3.2 97.79,6.35 107.32,6.35 107.95,6.99 v107.95,12.06 | v17.15,6.99 52.07,6.99 52.71,6.35 v53.98,6.35 | v74.93,34.29 v59.69,34.29 | v78.74,24.13 90.81,24.13 92.71,22.23 v93.98,22.23
N$45  (via drill 0.81)
  Top 0.406: v81.92,48.9 E11.20 | v62.23,49.53 v62.23,52.07 | v55.88,49.53 54.61,48.26 v54.61,45.72 | v36.2,45.72 34.29,43.81 v34.29,36.83 | v15.88,36.83 14.61,35.56 8.26,35.56 U$1.M1
  Bottom 0.406: v81.92,48.9 81.28,49.53 73.03,49.53 72.39,50.16 72.39,52.07 v62.23,52.07 | v55.88,49.53 v62.23,49.53 | v36.2,45.72 v54.61,45.72 | v15.88,36.83 v34.29,36.83
OUTHIGH
  Top 0.406: E11.3 78.74,56.52 83.19,52.07 85.09,52.07 85.09,53.98 87.63,56.52 87.63,57.78 89.54,59.69 95.25,59.69 95.25,42.55 96.52,41.27 E8.10
OUTLOW  (via drill 0.81)
  Top 0.406: v71.12,54.61 E11.6 | v90.17,35.56 v90.17,54.61
  Bottom 0.406: v90.17,54.61 v71.12,54.61 | E8.9 v90.17,35.56
SELECT0  (via drill 0.81)
  Top 0.406: E8.4 105.41,44.45 v105.41,55.88
  Bottom 0.406: v105.41,55.88 106.68,57.15 115.57,57.15 E12.1
SELECT2
  Top 0.406: E8.5 101.6,48.9 102.87,50.16 102.87,55.24 105.41,57.78 105.41,59.05 106.05,59.69 111.76,59.69 E12.3
SELECT4
  Top 0.406: E8.6 100.33,44.45 100.33,54.61 E12.6
SELECT6
  Top 0.406: E8.7 97.79,44.45 97.79,57.15 E12.8
SYN_L  (via drill 0.81)
  Top 0.406: E4.18 110.49,19.05 110.49,12.06 107.32,8.89 100.33,8.89 100.33,20.95 v95.89,25.4 | v15.88,25.4 14.61,26.67 8.26,26.67 U$1.J1
  Bottom 0.406: v15.88,25.4 v95.89,25.4
TESTPOINT  (via drill 0.81)
  Top 0.406: E4.1 114.3,25.4 E4.19 | E12.10 92.71,57.15 92.71,26.67 E4.13 99.06,18.41 v96.52,15.88 | v34.29,26.67 34.29,15.24 v40.01,9.53
  Bottom 0.406: E4.13 100.33,21.59 113.03,21.59 E4.19 | v34.29,26.67 27.31,26.67 23.5,30.48 16.51,30.48 14.61,32.38 8.26,32.38 U$1.L2 | v40.01,9.53 62.23,9.53 62.87,10.16 71.76,10.16 73.03,11.43 76.84,11.43 81.28,15.88 v96.52,15.88
VCC  (via drill 0.81)
  Top 0.406: C8.1 110.49,40.64 110.49,49.53 E12.17 106.68,53.34 E12.5 E12.19 | E7.5 74.93,44.45 74.93,53.34 | 74.93,53.34 74.93,55.24 73.66,56.52 E11.5 | v76.84,53.34 74.93,53.34 | R1.2 C9.1 146.05,38.1 | 146.05,48.26 144.78,48.26 C13.1 | 146.05,48.26 RN1.1 | 146.05,48.26 146.05,38.1 | C5.1 146.05,22.86 146.05,38.1 | C12.1 120.65,50.8 120.65,22.86 C4.1 | E6.5 40.64,48.9 39.37,50.16 39.37,57.15 E10.5 | v20.96,57.15 20.96,24.77 24.77,20.95 24.77,6.99 C14.+ | v40.64,22.86 E2.5 | C10.1 57.15,52.07 57.15,40.64 C6.1 52.07,35.56 52.07,22.86 C2.1 53.34,7.62 v51.44,5.71 | E3.5 76.84,24.77 v76.84,24.13 | C7.1 86.36,28.57 87.63,27.3 87.63,22.86 C3.1 | R2.2 105.41,11.43 105.41,26.04 106.68,27.3 E4.5
  Bottom 0.406: E12.19 115.57,52.07 C12.1 | E8.16 113.03,36.83 C8.1 | 100.33,52.07 E12.14 | 100.33,52.07 97.79,52.07 E12.12 E12.11 87.63,50.8 C11.1 83.19,52.07 81.92,53.34 v76.84,53.34 | E12.17 107.95,52.07 100.33,52.07 | C5.1 142.24,21.59 | 142.24,21.59 C4.1 116.84,24.13 97.79,24.13 | 142.24,21.59 E5.14 | E9.14 143.51,36.83 C9.1 | E13.14 143.51,52.07 C13.1 | U$1.A2 8.26,4.45 22.23,4.45 C14.+ 23.5,5.71 v51.44,5.71 | E10.5 39.37,57.15 v20.96,57.15 | v40.64,22.86 41.91,21.59 C2.1 54.61,22.86 78.11,22.86 | 78.11,22.86 v76.84,24.13 | 78.11,22.86 85.09,22.86 C3.1 87,20.95 93.35,20.95 E4.11 97.79,24.13 | E1.14 77.47,6.35 C1.1 90.81,6.35 95.89,11.43 105.41,11.43 R2.2 | 97.79,24.13 100.33,26.67 105.41,26.67 E4.5

### Text on the board
Top: M105 Address Selector
Bottom: M105 Address Selector